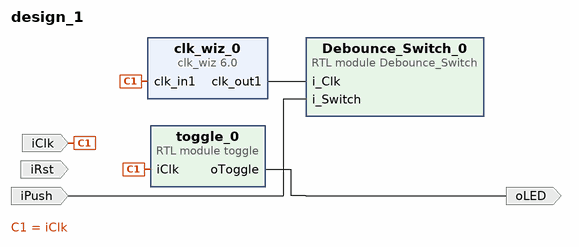
[diagram p0: block diagram of the top level]
# Vivado block design design_1, xc7z020clg400-1, Vivado 2025.1
create_bd_design design_1

create_bd_port -dir I -type clk iClk
create_bd_port -dir O oLED
create_bd_port -dir I iPush
create_bd_port -dir I -type rst iRst
set_property -dict {CONFIG.POLARITY ACTIVE_HIGH} [get_bd_ports iRst]

create_bd_cell -type ip -vlnv xilinx.com:ip:clk_wiz:6.0 clk_wiz_0
set_property -dict [list \
  CONFIG.CLKIN1_JITTER_PS 80.0 \
  CONFIG.CLKOUT1_JITTER 312.659 \
  CONFIG.CLKOUT1_PHASE_ERROR 245.713 \
  CONFIG.CLKOUT1_REQUESTED_OUT_FREQ 25 \
  CONFIG.CLK_IN1_BOARD_INTERFACE sys_clock \
  CONFIG.MMCM_CLKFBOUT_MULT_F 36.500 \
  CONFIG.MMCM_CLKIN1_PERIOD 8.000 \
  CONFIG.MMCM_CLKOUT0_DIVIDE_F 36.500 \
  CONFIG.MMCM_DIVCLK_DIVIDE 5 \
  CONFIG.USE_LOCKED false \
  CONFIG.USE_RESET false \
] [get_bd_cells clk_wiz_0]
create_bd_cell -type module -reference toggle toggle_0
create_bd_cell -type module -reference Debounce_Switch Debounce_Switch_0

# ---- connections ----

connect_bd_net -net clk_in1_0_1 [get_bd_ports iClk] [get_bd_pins clk_wiz_0/clk_in1] [get_bd_pins toggle_0/iClk]
connect_bd_net [get_bd_pins clk_wiz_0/clk_out1] [get_bd_pins Debounce_Switch_0/i_Clk]
connect_bd_net -net i_Switch_0_1 [get_bd_ports iPush] [get_bd_pins Debounce_Switch_0/i_Switch]
connect_bd_net [get_bd_pins toggle_0/oToggle] [get_bd_ports oLED]

validate_bd_design
save_bd_design
